# EasyEDA schematic Schematic.json
TITLE: Sheet_1; REV: 1.0; Date: 2025-10-22; Sheet: 1/1; Drawn By: ian.tawileh; Company: Your Company
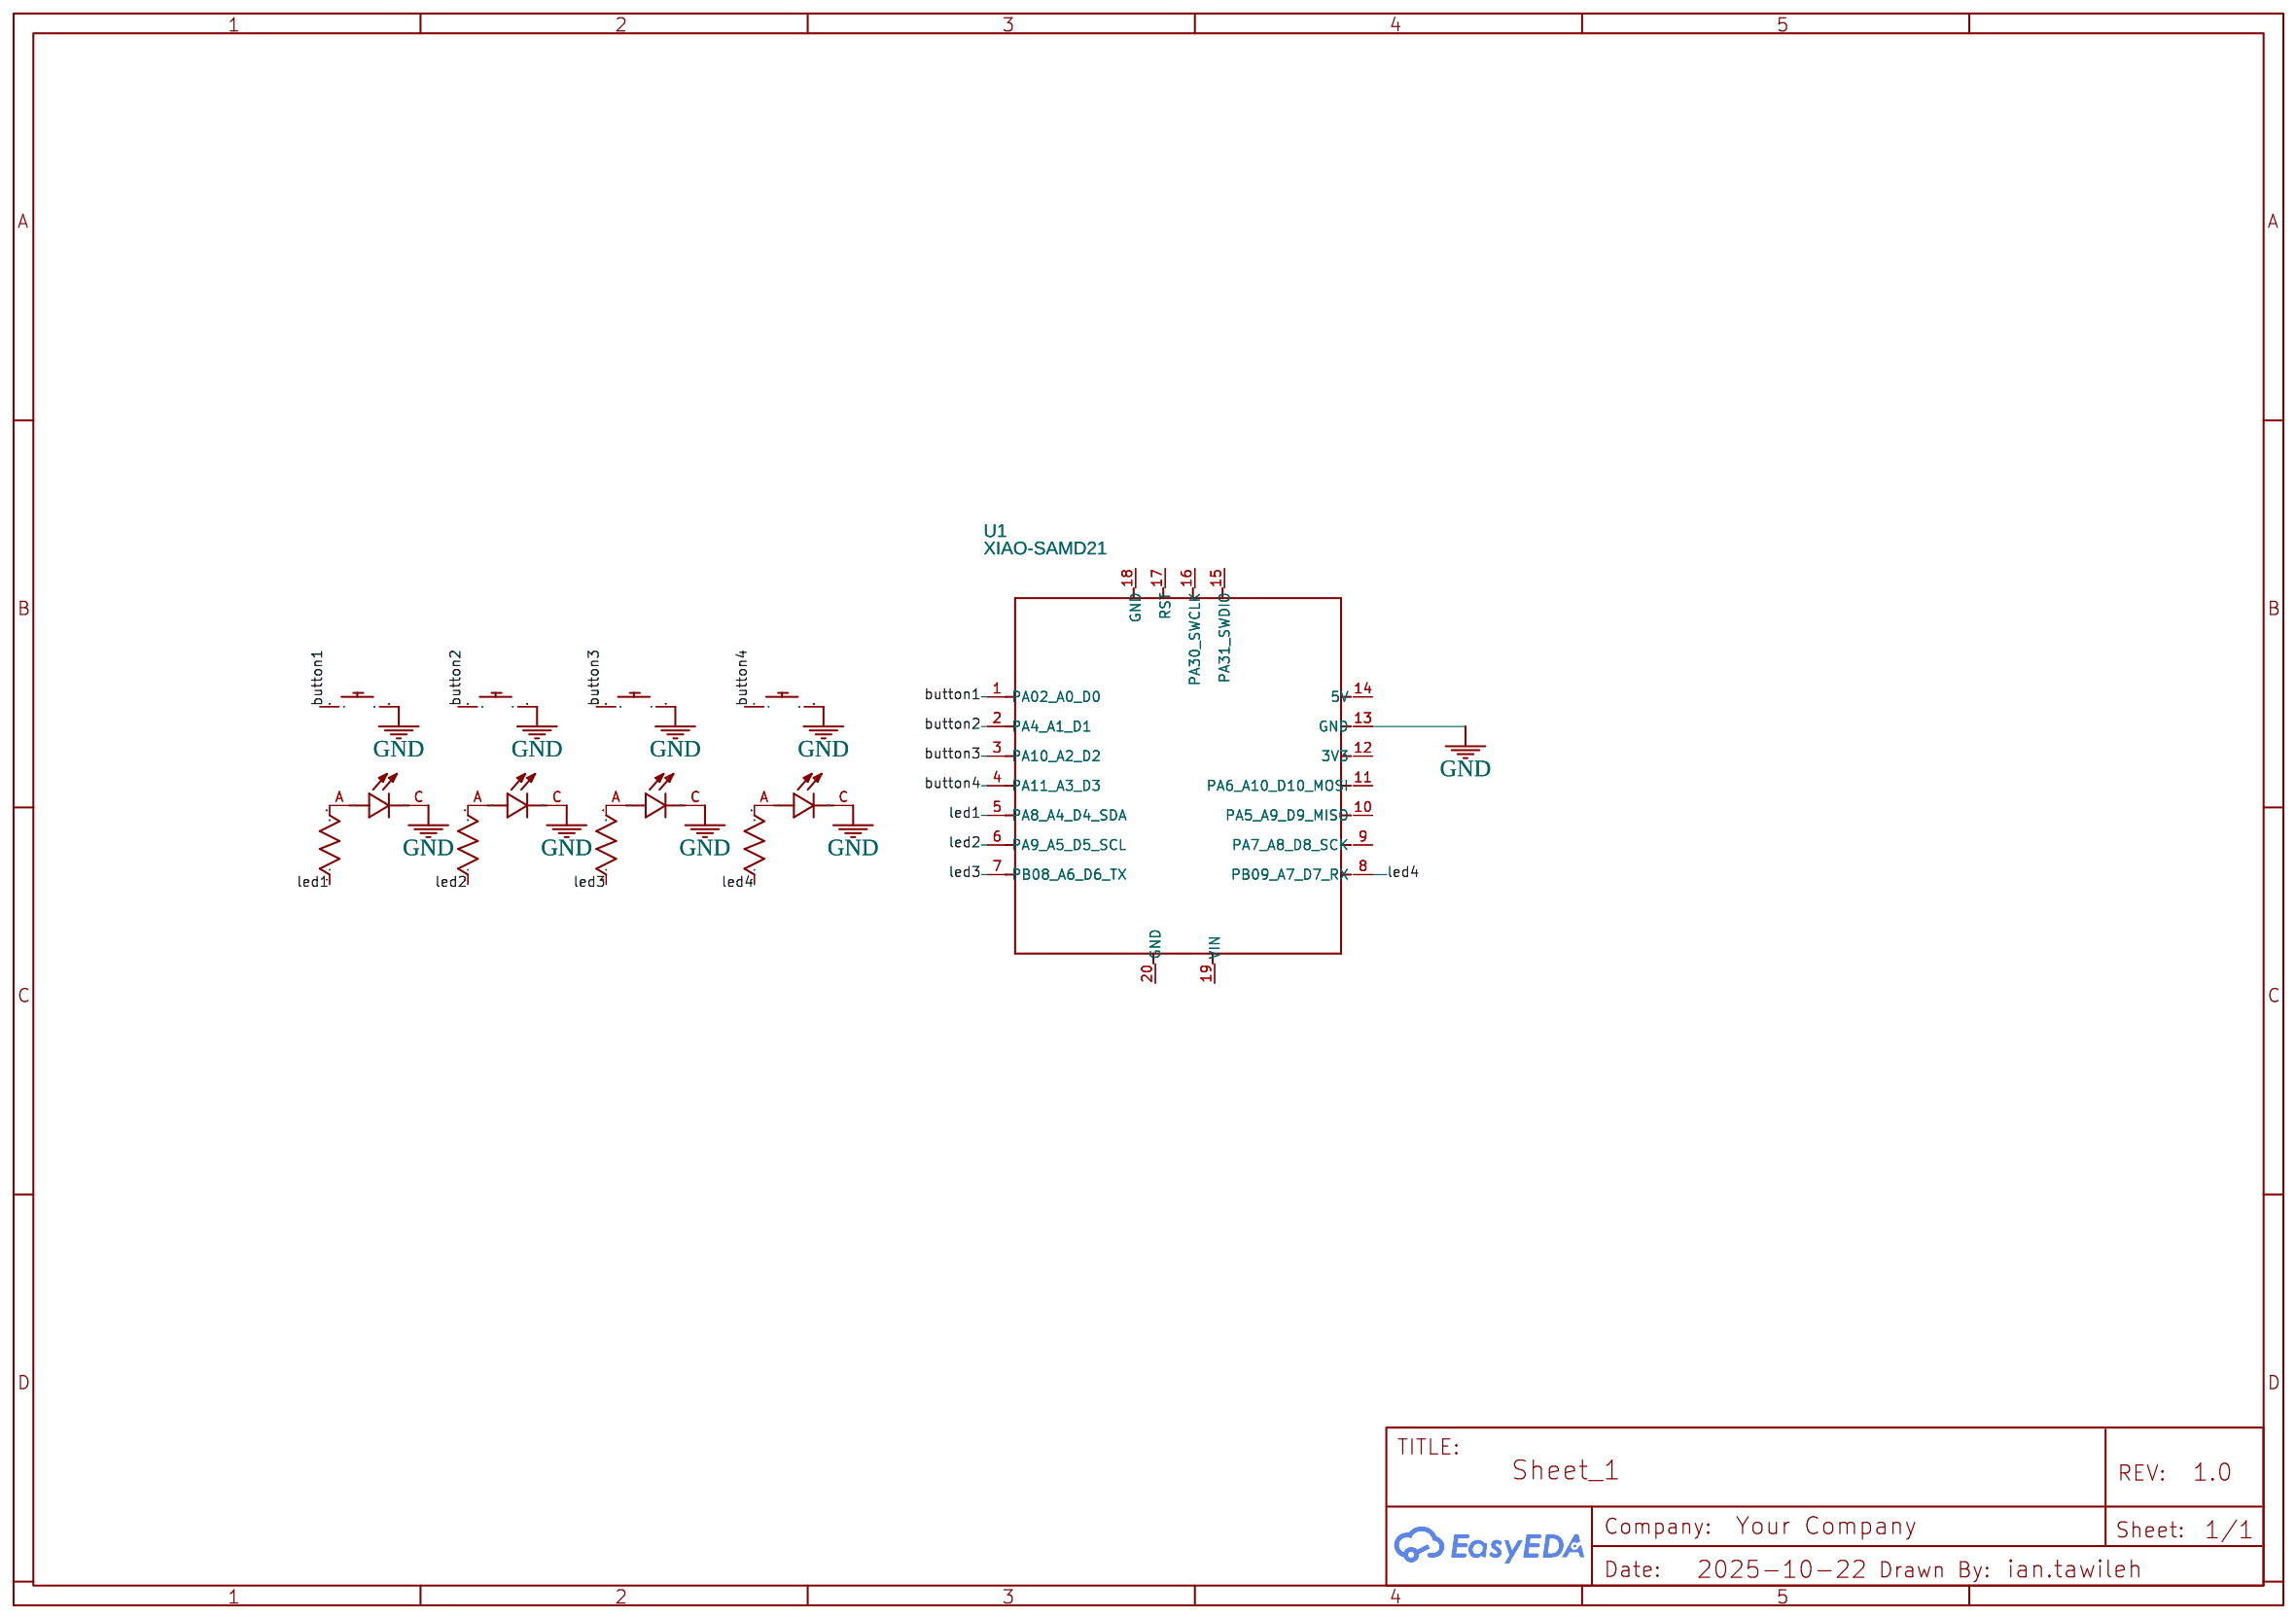
[diagram p0: schematic sheet]

## Parts
D1  L08R5000Q1  [LEDRD254W57D500H1070]
D2  L08R5000Q1  [LEDRD254W57D500H1070]
D3  L08R5000Q1  [LEDRD254W57D500H1070]
D4  L08R5000Q1  [LEDRD254W57D500H1070]
R1  1k  [R_AXIAL_DIN0204_L3.6MM_D1.6MM_P5.08MM_HORIZONTAL]
R2  1k  [R_AXIAL_DIN0204_L3.6MM_D1.6MM_P5.08MM_HORIZONTAL]
R3  1k  [R_AXIAL_DIN0204_L3.6MM_D1.6MM_P5.08MM_HORIZONTAL]
R4  1k  [R_AXIAL_DIN0204_L3.6MM_D1.6MM_P5.08MM_HORIZONTAL]
S1  CHERRY_CHERRY_MX  [CHERRYMX_1.00U]
S2  CHERRY_CHERRY_MX  [CHERRYMX_1.00U]
S3  CHERRY_CHERRY_MX  [CHERRYMX_1.00U]
S4  CHERRY_CHERRY_MX  [CHERRYMX_1.00U]
U1  XIAO-SAMD21  [XIAO-SAMD21/RP2040-MODULE14P-2.54-21X17.8MM]

## Library data of the parts
D1-D4 = L08R5000Q1: Contributor: aleca
R1-R4 = R_0603_US: Contributor: LCEDA_Lib
S1-S4 = CHERRY_CHERRY_MX: Contributor: Kemmalot
U1 = XIAO-SAMD21: Contributor: Jesusdparra

## Nets
GND: D1.C D2.C D3.C D4.C S1.2 S2.2 S3.2 S4.2 U1.13(GND)
button1: S1.1 U1.1(PA02_A0_D0)
button2: S2.1 U1.2(PA4_A1_D1)
button3: S3.1 U1.3(PA10_A2_D2)
button4: S4.1 U1.4(PA11_A3_D3)
led1: R1.1 U1.5(PA8_A4_D4_SDA)
led2: R2.1 U1.6(PA9_A5_D5_SCL)
led3: R3.1 U1.7(PB08_A6_D6_TX)
led4: R4.1 U1.8(PB09_A7_D7_RX)
Net-(D1-A): D1.A R1.2
Net-(D2-A): D2.A R2.2
Net-(D3-A): D3.A R3.2
Net-(D4-A): D4.A R4.2

Not connected (* = marked no-connect by the designer): U1 9(PA7_A8_D8_SCK) 10(PA5_A9_D9_MISO) 11(PA6_A10_D10_MOSI) 12(3V3) 14(5V) 15(PA31_SWDIO) 16(PA30_SWCLK) 17(RST) 18(GND) 19(VIN) 20(GND)
